# Altium schematic sheet Epsilon_remote.SchDoc
size 420 x 297 mm; SheetNumber: 1; SheetTotal: 1
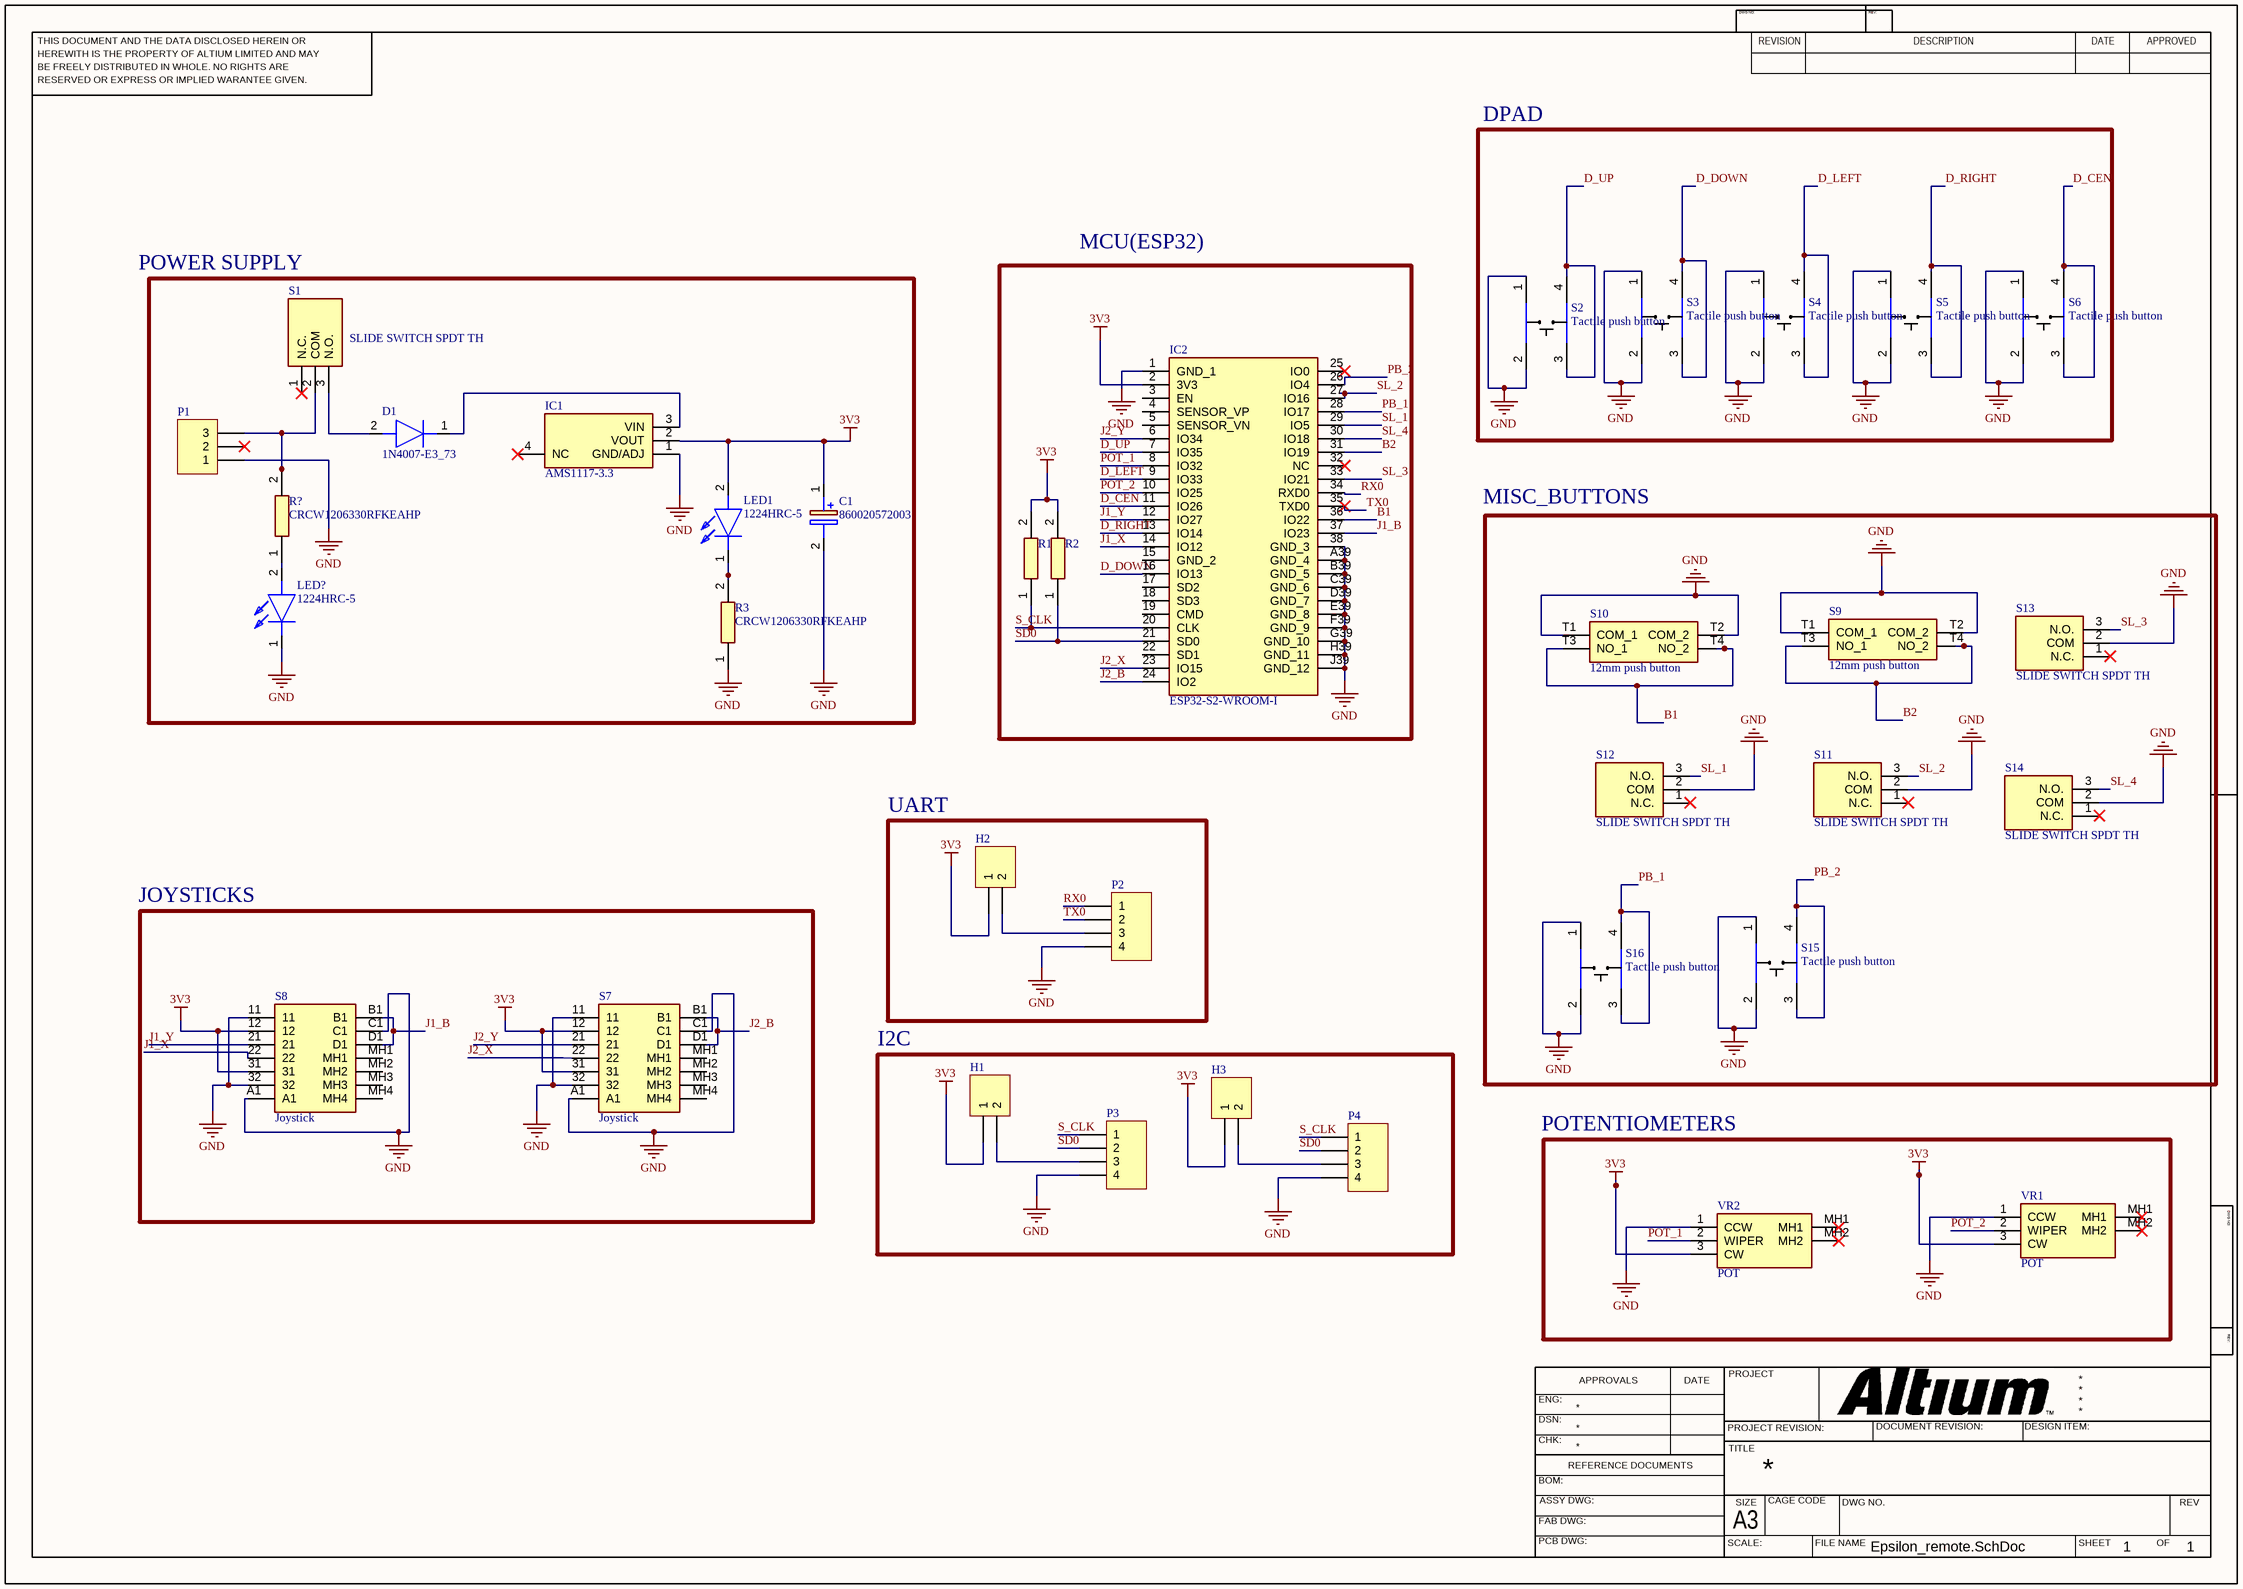
[diagram p0: Epsilon_remote.SchDoc]

## Parts
C1  860020572003  [CAPPRD200W52D500H1250]
D1  1N4007-E3_73  [DIOAD1405W86L465D235]
H1  Header 2  [My_1X02]  (value not drawn)
H2  Header 2  [My_1X02]  (value not drawn)
H3  Header 2  [My_1X02]  (value not drawn)
IC1  AMS1117-3.3  [SOT229P700X180-4N]
IC2  ESP32-S2-WROOM-I  [ESP32 BREAKOUT]
LED1  1224HRC-5  [1224HRC5]
LED?  1224HRC-5  [1224HRC5]
P1  Header 3  [MY_6410-03]  (value not drawn)
P2  Header 4  [HEADER 4]  (value not drawn)
P3  Header 4  [HEADER 4]  (value not drawn)
P4  Header 4  [HEADER 4]  (value not drawn)
R1  MRS25000C1000FC100  [RESAD1650W60L650D250]  (value not drawn)
R2  MRS25000C1000FC100  [RESAD1650W60L650D250]  (value not drawn)
R3  CRCW1206330RFKEAHP  [RESC3116X65N]
R?  CRCW1206330RFKEAHP  [RESC3116X65N]
S1  SLIDE SWITCH SPDT TH  [SDPT SLIDE SWITCH TH]
S2  Tactile push button  [PUSH BUTTON]
S3  Tactile push button  [PUSH BUTTON]
S4  Tactile push button  [PUSH BUTTON]
S5  Tactile push button  [PUSH BUTTON]
S6  Tactile push button  [PUSH BUTTON]
S7  Joystick  [JOYSTICK]
S8  Joystick  [JOYSTICK]
S9  12mm push button  [push button 12mm]
S10  12mm push button  [push button 12mm]
S11  SLIDE SWITCH SPDT TH  [SDPT SLIDE SWITCH TH]
S12  SLIDE SWITCH SPDT TH  [SDPT SLIDE SWITCH TH]
S13  SLIDE SWITCH SPDT TH  [SDPT SLIDE SWITCH TH]
S14  SLIDE SWITCH SPDT TH  [SDPT SLIDE SWITCH TH]
S15  Tactile push button  [PUSH BUTTON]
S16  Tactile push button  [PUSH BUTTON]
VR1  POT  [POT]
VR2  POT  [POT]

## Blocks framed on the sheet
DPAD: S2-S6
MCU(ESP32): IC2 R1 R2
MISC_BUTTONS: S9-S16
UART: H2 P2
JOYSTICKS: S7 S8
I2C: H1 H3 P3 P4
POTENTIOMETERS: VR1 VR2

## Nets
3V3: C1.1(+) H1.1 H2.1 H3.1 IC1.2(VOUT) IC2.2(3V3) LED1.2(A) R1.2 R2.2 S7.12 S7.31 S8.12 S8.31 VR1.3(CW) VR2.3(CW)
GND: C1.2(-) IC1.1(GND/ADJ) IC2.1(GND_1) IC2.38(GND_3) IC2.A39(GND_4) IC2.B39(GND_5) IC2.C39(GND_6) IC2.D39(GND_7) IC2.E39(GND_8) IC2.F39(GND_9) IC2.G39(GND_10) IC2.H39(GND_11) IC2.J39(GND_12) LED?.1(K) P1.1 P2.4 P3.4 P4.4 R3.1 S2.1(NO_1) S2.2(NO_2) S3.1(NO_1) S3.2(NO_2) S4.1(NO_1) S4.2(NO_2) S5.1(NO_1) S5.2(NO_2) S6.1(NO_1) S6.2(NO_2) S7.11 S7.32 S7.A1 S7.C1 S8.11 S8.32 S8.A1 S8.C1 S9.T1(COM_1) S9.T2(COM_2) S10.T1(COM_1) S10.T2(COM_2) S11.2(COM) S12.2(COM) S13.2(COM) S14.2(COM) S15.1(NO_1) S15.2(NO_2) S16.1(NO_1) S16.2(NO_2) VR1.1(CCW) VR2.1(CCW)
B1: IC2.36(IO22) S10.T3(NO_1) S10.T4(NO_2)
B2: IC2.31(IO19) S9.T3(NO_1) S9.T4(NO_2)
D_CEN: IC2.11(IO26) S6.3(COM_1) S6.4(COM_2)
D_DOWN: IC2.16(IO13) S3.3(COM_1) S3.4(COM_2)
D_LEFT: IC2.9(IO33) S4.3(COM_1) S4.4(COM_2)
D_RIGHT: IC2.13(IO14) S5.3(COM_1) S5.4(COM_2)
D_UP: IC2.7(IO35) S2.3(COM_1) S2.4(COM_2)
J1_B: IC2.37(IO23) S8.B1 S8.D1
J1_X: IC2.14(IO12) S8.22
J1_Y: IC2.12(IO27) S8.21
J2_B: IC2.24(IO2) S7.B1 S7.D1
J2_X: IC2.23(IO15) S7.22
J2_Y: IC2.6(IO34) S7.21
PB_1: IC2.28(IO17) S16.3(COM_1) S16.4(COM_2)
PB_2: IC2.26(IO4) S15.3(COM_1) S15.4(COM_2)
POT_1: IC2.8(IO32) VR2.2(WIPER)
POT_2: IC2.10(IO25) VR1.2(WIPER)
RX0: IC2.34(RXD0) P2.1
S_CLK: IC2.20(CLK) P3.1 P4.1 R1.1
SD0: IC2.21(SD0) P3.2 P4.2 R2.1
SL_1: IC2.29(IO5) S12.3(N.O.)
SL_2: IC2.27(IO16) S11.3(N.O.)
SL_3: IC2.33(IO21) S13.3(N.O.)
SL_4: IC2.30(IO18) S14.3(N.O.)
TX0: IC2.35(TXD0) P2.2
NetD1_1: D1.1(K) IC1.3(VIN)
NetD1_2: D1.2(A) S1.3(N.O.)
NetH1_2: H1.2 P3.3
NetH2_2: H2.2 P2.3
NetH3_2: H3.2 P4.3
NetLED1_1: LED1.1(K) R3.2
NetLED?_2: LED?.2(A) R?.1
NetP1_3: P1.3 R?.2 S1.2(COM)

Not connected (* = marked no-connect by the designer): IC1 4(NC)*; IC2 3(EN) 4(SENSOR_VP) 5(SENSOR_VN) 15(GND_2) 17(SD2) 18(SD3) 19(CMD) 22(SD1) 25(IO0)* 32(NC)*; P1 2*; S1 1(N.C.)*; S7 MH1 MH2 MH3 MH4; S8 MH1 MH2 MH3 MH4; S11 1(N.C.)*; S12 1(N.C.)*; S13 1(N.C.)*; S14 1(N.C.)*; VR1 MH1* MH2*; VR2 MH1* MH2*

## Notes on the sheet
- POWER SUPPLY
- THIS DOCUMENT AND THE DATA DISCLOSED HEREIN OR
- HEREWITH IS THE PROPERTY OF ALTIUM LIMITED AND MAY
- DWG NO:
- REVISION
- REV:
- DESCRIPTION
- DATE
- APPROVED
- BE FREELY DISTRIBUTED IN WHOLE. NO RIGHTS ARE
- RESERVED OR EXPRESS OR IMPLIED WARANTEE GIVEN.
- ENG:
- APPROVALS
- PROJECT
- DSN:
- CHK:
- REFERENCE DOCUMENTS
- PROJECT REVISION:
- TITLE
- DOCUMENT REVISION:
- DESIGN ITEM:
- BOM:
- FAB DWG:
- PCB DWG:
- ASSY DWG:
- SCALE:
- A3
- SIZE
- CAGE CODE
- FILE NAME
- DWG NO.
- SHEET
- OF
- REV

## Library data of the parts
C1 = 860020572003: Capacitor Polarised; Manufacturer_Name: Wurth Elektronik; Datasheet Link: https://www.we-online.de/katalog/datasheet/860020572003.pdf; Height: 12.5mm; Manufacturer_Part_Number: 860020572003; Mouser Part Number: 710-860020572003; Mouser Price/Stock: https://www.mouser.co.uk/ProductDetail/Wurth-Elektronik/860020572003?qs=0KOYDY2FL28Nvm4U9TAejQ%3D%3D
D1 = 1N4007-E3_73: Diode; Manufacturer_Name: Vishay; Manufacturer_Part_Number: 1N4007-E3/73; Datasheet Link: https://mouser.componentsearchengine.com/Datasheets/2/1N4007-E3_73.pdf; Mouser Part Number: 625-1N4007-E3/73; Mouser Price/Stock: https://www.mouser.co.uk/ProductDetail/Vishay-General-Semiconductor/1N4007-E3-73?qs=N4vtoAxH%2FSqT3Ng3e4K0Gw%3D%3D; Arrow Part Number: 1N4007-E3/73; Arrow Price/Stock: https://www.arrow.com/en/products/1n4007-e373/vishay?region=asia
H1-H3 = Header 2: Header, 2-Pin; ASiD Part Number: Header 2-AS
IC1 = AMS1117-3.3: Integrated Circuit; Manufacturer_Name: Advanced; Datasheet Link: https://datasheet.datasheetarchive.com/originals/distributors/Datasheets-28/DSA-550594.pdf; Height: 1.8mm; Manufacturer_Part_Number: AMS1117-3.3
IC2 = ESP32-S2-WROOM-I: Integrated Circuit; Manufacturer_Name: Espressif Systems; Datasheet Link: https://www.espressif.com/sites/default/files/documentation/esp32-wroom-32_datasheet_en.pdf; Height: 3.1mm; Manufacturer_Part_Number: ESP32-S2-WROOM-I; Mouser Part Number: 356-ESP32S2WRMI320UH; Mouser Price/Stock: https://www.mouser.co.uk/ProductDetail/Espressif-Systems/ESP32-S2-WROOM-I?qs=GBLSl2Akirt8iWPUDAQYQQ%3D%3D
LED1 LED? = 1224HRC-5: LED; Manufacturer_Name: Everlight; Datasheet Link: https://www.digchip.com/datasheets/parts/datasheet/158/1224HRC-5-pdf.php; Height: 5.5mm; Manufacturer_Part_Number: 1224HRC-5
P1 = Header 3: Header, 3-Pin; ASiD Part Number: Header 3-AS
P2-P4 = Header 4: Header, 4-Pin; ASiD Part Number: Header 4-AS
R1 R2 = MRS25000C1000FC100: Resistor; Manufacturer_Name: Vishay; Datasheet Link: http://www.vishay.com/docs/28724/mrs16m25.pdf; Manufacturer_Part_Number: MRS25000C1000FC100; Mouser Part Number: 594-2322-156-11001; Mouser Price/Stock: https://www.mouser.co.uk/ProductDetail/Vishay-BC-Components/MRS25000C1000FC100?qs=H30XFsNYD%2FEegjN4bN4g8Q%3D%3D; Arrow Part Number: MRS25000C1000FC100; Arrow Price/Stock: https://www.arrow.com/en/products/mrs25000c1000fc100/vishay?region=europe
R3 R? = CRCW1206330RFKEAHP: Resistor; Manufacturer_Name: Vishay; Datasheet Link: http://componentsearchengine.com/Datasheets/1/CRCW1206330RFKEAHP.pdf; Height: 0.65mm; Manufacturer_Part_Number: CRCW1206330RFKEAHP; Mouser Part Number: 71-CRCW1206330RFKEAH; Mouser Price/Stock: https://www.mouser.co.uk/ProductDetail/Vishay-Dale/CRCW1206330RFKEAHP?qs=40TFAHZMFvdKAHSCu4RwVA%3D%3D; Arrow Part Number: CRCW1206330RFKEAHP; Arrow Price/Stock: https://www.arrow.com/en/products/crcw1206330rfkeahp/vishay?region=nac
S1 S11-S14 = SLIDE SWITCH SPDT TH: Switch; Manufacturer_Name: ALPS Electric; Manufacturer_Part_Number: SSSS912500; Datasheet Link: https://www.alps.com/prod/info/E/HTML/Switch/Slide/SSSS9/SSSS912500.html; Height: 9mm; Mouser Part Number: 688-SSSS912500; Mouser Price/Stock: https://www.mouser.com/Search/Refine.aspx?Keyword=688-SSSS912500; Arrow Part Number: SSSS912500; Arrow Price/Stock: https://www.arrow.com/en/products/ssss912500/alps-electric
S2-S6 S15 S16 = Tactile push button: Switch; Manufacturer_Name: SCHURTER; Manufacturer_Part_Number: 1241.1602; Datasheet Link: https://www.schurter.com/en/datasheet/PMS; Height: 4.55mm; Mouser Part Number: 693-1241.1602; Mouser Price/Stock: https://www.mouser.co.uk/ProductDetail/Schurter/12411602?qs=JHn%2F0Af%2Fl5EgRnV0HUH1SQ%3D%3D
S7 S8 = Joystick: Manufacturer_Name: ALPS Electric; Manufacturer_Part_Number: RKJXK122000D; Height: 19.7mm; Mouser Part Number: 688-RKJXK122000D; Mouser Price/Stock: https://www.mouser.co.uk/ProductDetail/ALPS/RKJXK122000D?qs=m0BA540hBPe588JnPdeybQ%3D%3D
S9 S10 = 12mm push button: Switch; Manufacturer_Name: Apem; Manufacturer_Part_Number: ADTS25RV; Datasheet Link: https://media.digikey.com/pdf/Data%20Sheets/APEM%20Components%20PDFs/ADTS6,%20ADTSM,%20AKTSC6%20Series.pdf; Height: 9.5mm; Mouser Part Number: 642-ADTS25RV; Mouser Price/Stock: https://www.mouser.co.uk/ProductDetail/Apem/ADTS25RV?qs=ikKlZSMjbcRDCzQ0CyZHnw%3D%3D
VR1 VR2 = POT: Variable Resistor; Manufacturer_Name: Bourns; Manufacturer_Part_Number: PTV09A-4025S-A102; Datasheet Link: https://www.bourns.com/docs/Product-Datasheets/PTV09.pdf; Height: 25.5mm; Mouser Part Number: 652-PTV09A-4025SA102; Mouser Price/Stock: https://www.mouser.co.uk/ProductDetail/Bourns/PTV09A-4025S-A102?qs=pxDZlBjcsCgEr%252BU0PGMDlQ%3D%3D